# EAGLE schematic Schematics (EAGLE 7.7.0)
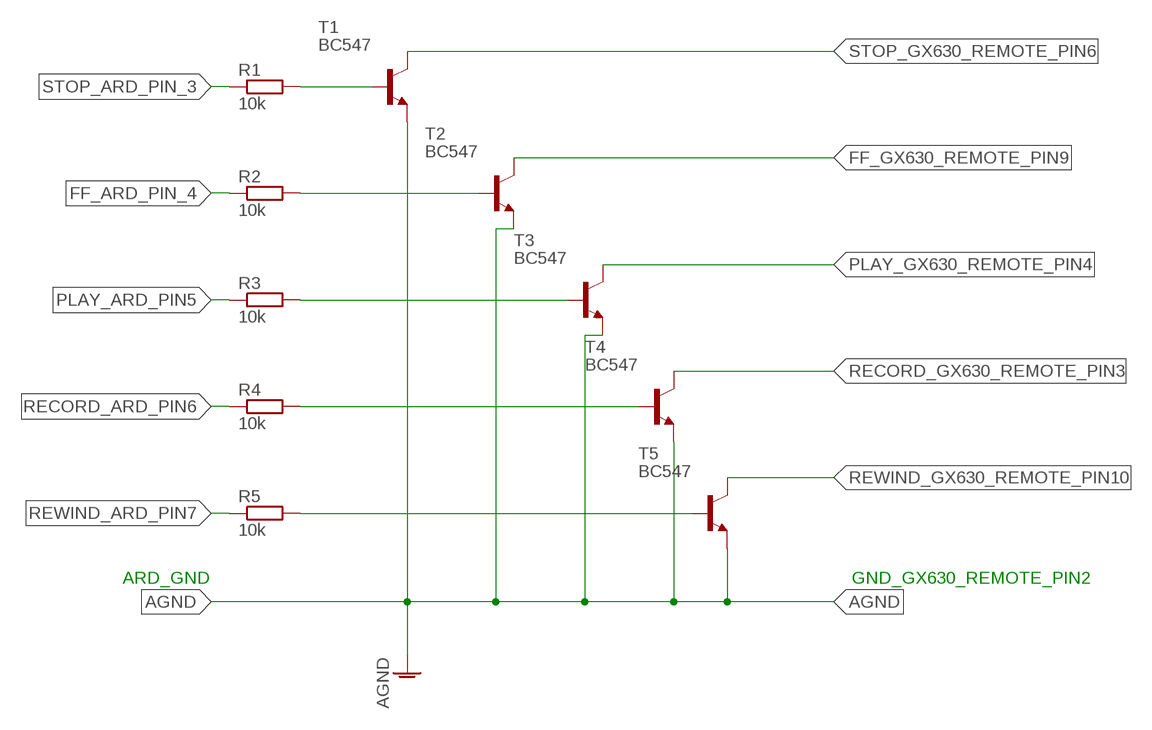
[diagram p0: schematic, sheet 1]

## Parts
R1  10k  R-EU_0207/10  [0207/10]
R2  10k  R-EU_0207/10  [0207/10]
R3  10k  R-EU_0207/10  [0207/10]
R4  10k  R-EU_0207/10  [0207/10]
R5  10k  R-EU_0207/10  [0207/10]
T1  BC547  [TO92]
T2  BC547  [TO92]
T3  BC547  [TO92]
T4  BC547  [TO92]
T5  BC547  [TO92]

## Nets
AGND: T1.1(E) T2.1(E) T3.1(E) T4.1(E) T5.1(E)
FF_ARD_PIN_4: R2.1
FF_GX630_REMOTE_PIN9: T2.3(C)
N$5: R1.2 T1.2(B)
N$6: R2.2 T2.2(B)
N$7: R3.2 T3.2(B)
N$8: R4.2 T4.2(B)
N$9: R5.2 T5.2(B)
PLAY_ARD_PIN5: R3.1
PLAY_GX630_REMOTE_PIN4: T3.3(C)
RECORD_ARD_PIN6: R4.1
RECORD_GX630_REMOTE_PIN3: T4.3(C)
REWIND_ARD_PIN7: R5.1
REWIND_GX630_REMOTE_PIN10: T5.3(C)
STOP_ARD_PIN_3: R1.1
STOP_GX630_REMOTE_PIN6: T1.3(C)

## Notes on the sheet
- ARD_GND | GND_GX630_REMOTE_PIN2

## Library data of the parts
R1-R5 = resistor:R-EU_: RESISTOR, European symbol
T1-T5 = transistor:BC547: NPN TRANSISTOR